# EAGLE design ChronoBlot (EAGLE 5.10)
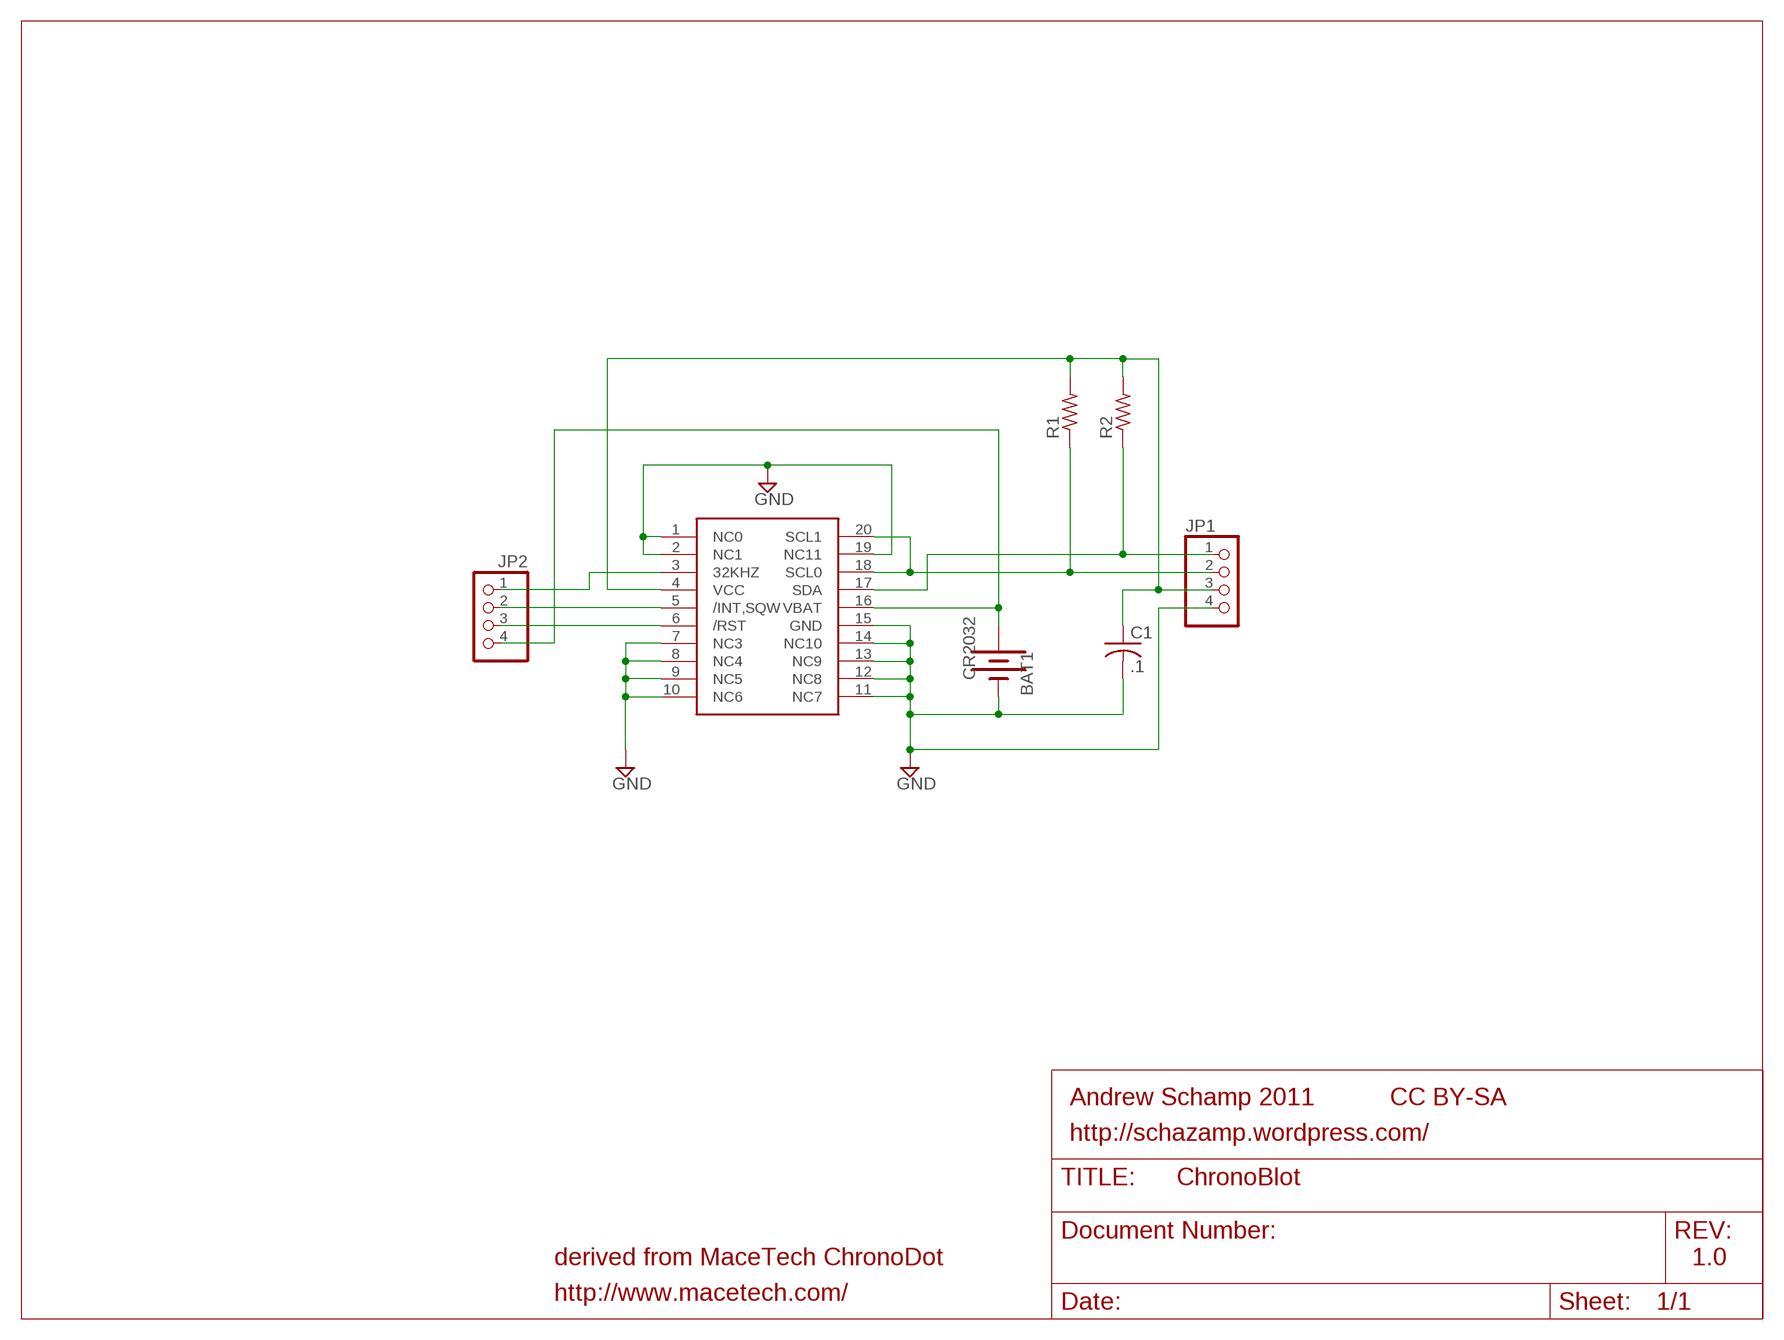
[diagram p0: schematic, sheet 1]

## Parts
BAT1  CR2032  BATTERY  [BATTCOM_20MM_PTH_3]
C1  .1  C-USC0805  [C0805]
IC1  DS3232  [SO20W]
JP1  PINHD-1X4  [1X04]
JP2  PINHD-1X4  [1X04]
R1  R-US_R0805  [R0805]
R2  R-US_R0805  [R0805]

## Nets
FOO: C1.1 IC1.4(VCC) JP1.3 R1.2 R2.2
GND: BAT1.2(-) C1.2 IC1.1(NC0) IC1.2(NC1) IC1.7(NC3) IC1.8(NC4) IC1.9(NC5) IC1.10(NC6) IC1.11(NC7) IC1.12(NC8) IC1.13(NC9) IC1.14(NC10) IC1.15(GND) IC1.19(NC11) JP1.4
N$1: IC1.6(/RST) JP2.3
N$2: IC1.3(32KHZ) JP2.1
N$3: IC1.5(/INT,SQW) JP2.2
N$4: IC1.18(SCL0) IC1.20(SCL1) JP1.2 R1.1
N$7: IC1.17(SDA) JP1.1 R2.1
VBAT: BAT1.1(+) IC1.16(VBAT) JP2.4

## Notes on the sheet
- Andrew Schamp 2011 | CC BY-SA
- http://schazamp.wordpress.com/
- derived from MaceTech ChronoDot | 1.0
- http://www.macetech.com/

## Library data of the parts
BAT1 = ideabot:BATTERY: Battery Holders Various common sizes : AA, AAA, 20mm coin cell and 12mm coin cell.
C1 = rcl:C-US: CAPACITOR, American symbol
IC1 = ideabot:DS3232
JP1 JP2 = pinhead:PINHD-1X4: PIN HEADER
R1 R2 = resistor:R-US_: RESISTOR, American symbol

## Board
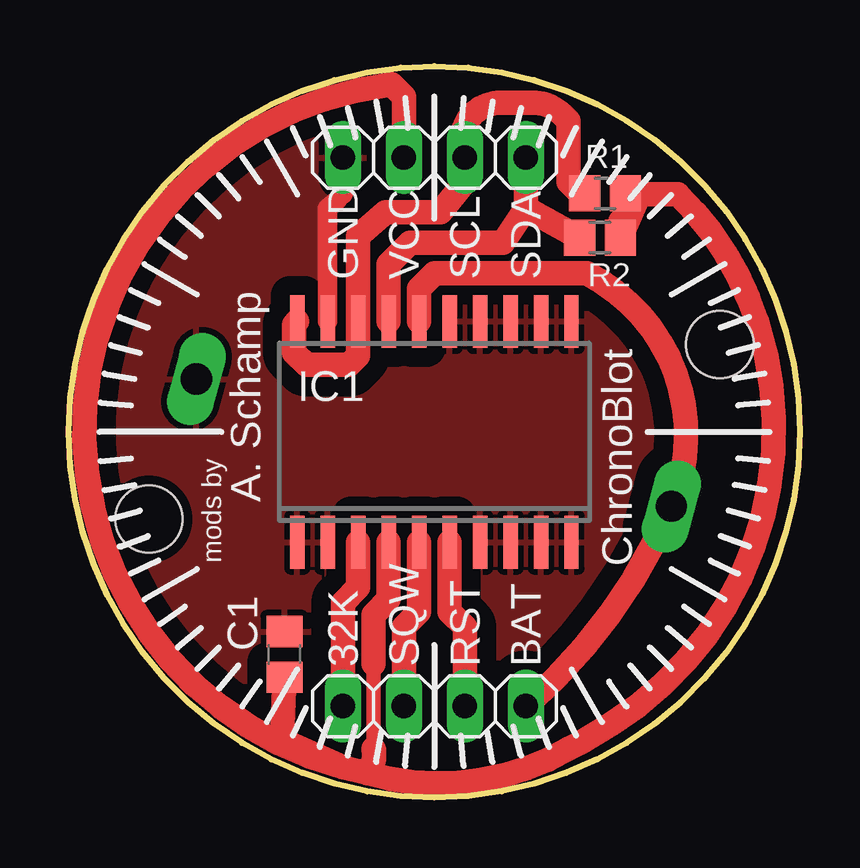
[diagram p1: board, top side]
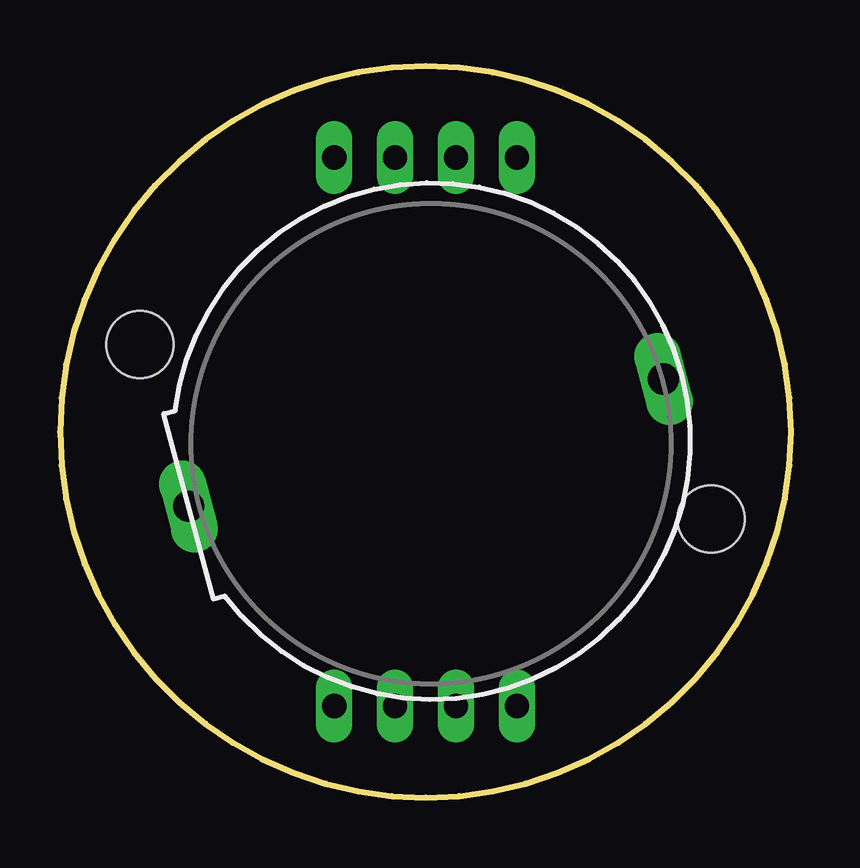
[diagram p2: board, bottom side, seen from below]

Size 30.48 x 30.48 mm. Coordinates in mm from the lower left corner, seen from the top.
Outline: 15.24,30.48 arc-90 30.48,15.24 arc-90 15.24,0 arc-90 0,15.24 arc-90 15.24,30.48
Copper layers (1*16): Top 0.035mm / dielectric 1.5mm / Bottom 0.035mm
Design rules "toner-transfer-flexible": minimum track width 0.8mm, minimum drill 0.8mm, track to track 0.8mm, track to pad 0.8mm, pad to pad 0.8mm, via to via 0.8mm, smd to smd 8mil, copper to edge 10mil, drill to drill 8mil, minimum pad ring 10mil, minimum via ring 8mil, stop-mask expansion 4mil, vias tented up to drill 0mil, thermal gap 10mil
Holes 2.8 mm at 27.14,18.88 3.34,11.6
bRestrict: 5 lines
Milling: 4 lines

### Footprints (pad centres in the part's own frame; a part is rotated, then mirrored left to right if it is on the bottom)
BATTCOM_20MM_PTH_3 = drill 1.3 long: 1 12,0; 2 -8.5,0
C0805 = smd 1.3 x 1.5: 1 -0.95,0; 2 0.95,0
SO20W = smd 0.6 x 2.2: 1 -5.715,-4.6; 2 -4.445,-4.6; 3 -3.175,-4.6; 4 -1.905,-4.6; 5 -0.635,-4.6; 6 0.635,-4.6; 7 1.905,-4.6; 8 3.175,-4.6; 9 4.445,-4.6; 10 5.715,-4.6; 11 5.715,4.6; 12 4.445,4.6; 13 3.175,4.6; 14 1.905,4.6; 15 0.635,4.6; 16 -0.635,4.6; 17 -1.905,4.6; 18 -3.175,4.6; 19 -4.445,4.6; 20 -5.715,4.6
1X04 = drill 1.016 long: 1 -3.81,0; 2 -1.27,0; 3 1.27,0; 4 3.81,0
R0805 = smd 1.3 x 1.5: 1 -0.85,0; 2 0.85,0

### Placement (x,y rotation side)
BAT1  13.53,15.24 195 bottom
C1  8.99,5.97 90 top
IC1  15.24,15.24 0 top
JP1  15.24,26.67 180 top
JP2  15.24,3.81 0 top
R1  22.36,25.18 0 top
R2  22.14,23.34 0 top

### Tracks (layer width: path | path; a pad name or v marks a point on that pad's centre or on a via)
FOO
  Top 0.61: 12.7,2.03 12.7,5.59
  Top 1.016: JP1.3 13.97,29.21 13.46,29.72 arc158 11.43,1.27 | IC1.4 13.34,8.26 12.7,7.62 12.7,5.59 | R1.2 23.37,25.02 23.37,24.38 22.99,24.01 R2.2 23.79,25.15 25.4,25.15 arc-28 28.7,19.81 arc-76 22.61,3.05 21.34,2.29 20.83,2.03 arc-46 12.45,1.02 | 12.45,1.02 arc53 12.7,2.03 | 11.43,1.27 12.45,1.02 | C1.1 8.89,2.54 9.14,2.29 11.43,1.27
GND
  Top 0.813: IC1.19 10.79,24.56 11.18,24.89 | 11.43,25.15 JP1.4
  pour Top (isolate 0.406): 15.24,30.48 arc-90 30.48,15.24 arc-90 15.24,0 arc-90 0,15.24 arc-90
N$1
  Top 1.016: IC1.6 15.88,7.75 16.51,7.11 JP2.3
N$2
  Top 1.016: IC1.3 12.06,8.76 11.43,8.13 JP2.1
N$3
  Top 1.016: IC1.5 14.61,7.75 13.97,7.11 JP2.2
N$4
  Top 0.813: 12.06,23.39 IC1.18 | 16.51,25.65 JP1.2
  Top 1.016: 16.51,25.65 15.49,24.38 13.21,24.38 12.06,23.39 12.06,18.41 11.68,18.03 9.91,18.03 9.4,18.54 9.4,19.71 IC1.20 | R1.1 21.31,25.18 20.83,25.65 20.83,28.19 20.57,28.45 arc46 19.3,28.96 arc-3 18.03,28.96 arc115 JP1.2
N$7
  Top 1.016: 19.05,24.57 JP1.1 | 19.05,24.57 R2.1 | IC1.17 13.34,22.23 14.22,23.11 18.11,23.11 19.05,24.57
VBAT
  Top 1.016: IC1.16 14.61,21.21 15.24,21.84 21.59,21.84 arc-87 BAT1.1 arc-26 JP2.4

### Text on the board
tNames: GND | VCC | SCL | SDA | A. Schamp | mods by | ChronoBlot | 32K | SQW | RST | BAT